# Altium schematic sheet [04] - USB-UART.SchDoc
size A4
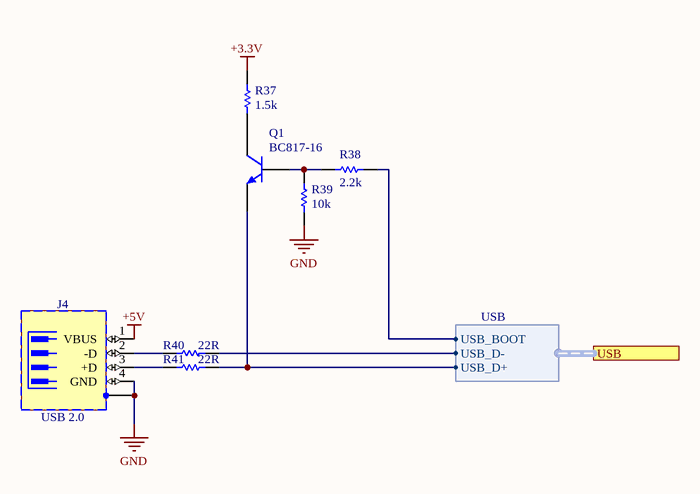
[diagram p0: [04] - USB-UART.SchDoc]

## Parts
J4  USB 2.0  [WURTH_614 104 150 121]
Q1  BC817-16  [SOT23-3]
R37  Resistance: 1.5k  [Res-0603]  (hidden comment: Res1)
R38  Resistance: 2.2k  [Res-0603]  (hidden comment: Res1)
R39  Resistance: 10k  [Res-0603]  (hidden comment: Res1)
R40  Resistance: 22R  [Res-0603]  (hidden comment: Res1)
R41  Resistance: 22R  [Res-0603]  (hidden comment: Res1)

## Ports
USB (harness USB)

## Harnesses
USB: USB_BOOT, USB_D-, USB_D+

## Nets
+3.3V: R37.1
+5V: J4.1(VBUS)
GND: J4.4(GND) J4.5(SHIELD) R39.1
NetJ4_2: J4.2(-D) R40.2
NetJ4_3: J4.3(+D) R41.2
NetQ1_1: Q1.1(B) R38.1 R39.2
NetQ1_2: Q1.2(E) R41.1 ; port USB.USB_D+
NetQ1_3: Q1.3(C) R37.2
NetR38_2: R38.2 ; port USB.USB_BOOT
NetR40_1: R40.1 ; port USB.USB_D-

## Notes on the sheet
- Title
- Size:
- Date:
- A4
- Number:
- Time:
- Revision:
- Sheet
- of
- File:

## Library data of the parts
J4 = WURTH_614 104 150 121: 4 Pin + 1 Shield USB Receptacle; Part Description: USB 2.0 Type A Receptacle, Right Angle, SLIM Type, 4 Contacts; Manufacturer: WURTH ELEKTRONIK; PressFit: No; Number of Contacts: 4; Part Number: WURTH_614 104 150 121; Component Kind: Standard; Component Type: Standard; Pin Count: 5; Family: USB 2.0; Mounted: Yes; Socket: No; SMD: No; Sense: No; Status: None; Manufacturer Part Number: 614 104 150 121; ComponentHeight: 7.2mm; HelpURL: \\cern.ch\dfs\Applications\Altium\Datasheets\WURTH_614 104 150 121.pdf; Author: CERN DEM JMW; CreateDate: 07.07.2015; LatestRevisionDate: 07.07.2015; Supplier 1: Digi-Key; Supplier Part Number 1: 732-5962-6-ND; Stock 1: 1074; Pricing 1: 1=2.1, 10=1.927, 50=1.784, 100=1.641 (USD); Mount: Through Hole,Horizontal; Contact Material: Copper Alloy; Contact Plating: Gold; Packaging: Tape and Reel; Connector Type: USB; Gender: Receptacle; Orientation: Right Angle; USB Standard: USB 2.0; REACH SVHC: Unknown; ComponentLink1URL: https://www.distrelec.biz/Web/Downloads/40/28/614104150121.pdf?mime=application%2Fpdf; ComponentLink1Description: https://www.distrelec.biz/Web/Downloads/40/28/614104150121.pdf?mime=application%2Fpdf; ComponentLink2URL: http://katalog.we-online.de/em/datasheet/614104150121.pdf; ComponentLink2Description: http://katalog.we-online.de/em/datasheet/614104150121.pdf; ComponentLink3URL: http://www.farnell.com/cad/2130935.pdf; ComponentLink3Description: http://www.farnell.com/cad/2130935.pdf; ComponentLink4URL: http://www.farnell.com/cad/1889803.pdf; ComponentLink4Description: http://www.farnell.com/cad/1889803.pdf
Q1 = BC817-16: NPN General-purpose Transistor; Manufacturer: ON Semiconductor; Manufacturer Part Number: BC817-16LT3G; hFE Min: 100; Max Power Dissipation: 300mW; Collector Emitter Voltage (VCEO): 45V; Max Collector Current: 500mA; Transition Frequency: 100MHz; Collector Base Voltage (VCBO): 50V; Emitter Base Voltage (VEBO): 5V; Collector Emitter Saturation Voltage: 700mV; Element Configuration: Single; Number of Elements: 1; ComponentLink1URL: http://www.mccsemi.com/up_pdf/BC817-16~BC817-40(SOT-23).pdf; ComponentLink1Description: http://www.mccsemi.com/up_pdf/BC817-16~BC817-40(SOT-23).pdf; Supplier 1: Digi-Key; Supplier Part Number 1: BC817-16LT3GOSDKR-ND; Stock 1: 22032; Pricing 1: 1=0.13, 10=0.121, 100=0.0658, 500=0.04048, 1000=0.02759 (USD); Case/Package: SOT-23-3; Number of Pins: 3; Contact Plating: Tin,Matte; Min Operating Temperature: -55°C; Max Operating Temperature: 150°C; Package Quantity: 10000; Packaging: Tape and Reel; Collector Emitter Breakdown Voltage: 45V; Polarity: NPN; Power Dissipation: 300mW; Frequency: 100MHz; Max Breakdown Voltage: 45V; Gain Bandwidth Product: 100MHz; Radiation Hardening: No; Lead Free: Lead Free; Halogen Free: Halogen Free; ComponentLink2URL: https://datasheet.ciiva.com/15139/getdatasheetpartid-84401-15139109.pdf; ComponentLink2Description: https://datasheet.ciiva.com/15139/getdatasheetpartid-84401-15139109.pdf; ComponentLink3URL: https://datasheet.ciiva.com/980/bc817-16lt1-d-980715.pdf; ComponentLink3Description: https://datasheet.ciiva.com/980/bc817-16lt1-d-980715.pdf; ComponentLink4URL: https://datasheet.ciiva.com/26115/bc817-16lt1-d-26115598.pdf; ComponentLink4Description: https://datasheet.ciiva.com/26115/bc817-16lt1-d-26115598.pdf; ComponentLink5URL: https://datasheet.ciiva.com/11204/bc817-16lt1-d-11204335.pdf; ComponentLink5Description: https://datasheet.ciiva.com/11204/bc817-16lt1-d-11204335.pdf
R37 = 1: Chip Resistor; Manufacturer: Panasonic; Manufacturer Part Number: ERJ-3EKF1501V; Power Rating: 100mW; Tolerance: 1%; Voltage Rating: 75V; Temperature Coefficient: 100ppm/°C; Supplier 1: Digi-Key; Supplier Part Number 1: P1.50KHDKR-ND; Stock 1: 965786; Pricing 1: 1=0.1, 10=0.079, 100=0.0323, 1000=0.01449, 2500=0.01258 (USD); Mount: Surface Mount; Case/Package: 0603; Number of Pins: 2; Weight: 7.1E-05oz; Case Code (Metric): 1608; Case Code (Imperial): 0603; Contact Plating: Tin; Min Operating Temperature: -55°C; Max Operating Temperature: 155°C; Packaging: Tape and Reel; Package Quantity: 1; Composition: Thick Film; Number of Terminations: 2; Termination: SMD/SMT; Military Standard: Not; Max Power Dissipation: 100mW; Voltage Rating (DC): 75V; Features: Automotive AEC-Q200; Length: 1.6mm; Height: 0.45mm; Width: 0.031inch; Depth: 0.8mm; Radiation Hardening: No; REACH SVHC: No SVHC; Lead Free: Lead Free; ComponentLink1URL: https://datasheet.ciiva.com/34303/1987644-34303574.pdf; ComponentLink1Description: https://datasheet.ciiva.com/34303/1987644-34303574.pdf; ComponentLink2URL: https://datasheet.ciiva.com/7830/426256-7830981.pdf; ComponentLink2Description: https://datasheet.ciiva.com/7830/426256-7830981.pdf; ComponentLink3URL: https://datasheet.ciiva.com/9198/aoa0000ce2-9198086.pdf; ComponentLink3Description: https://datasheet.ciiva.com/9198/aoa0000ce2-9198086.pdf; ComponentLink4URL: https://datasheet.ciiva.com/48530/aoa0000ce2-48530982.pdf; ComponentLink4Description: https://datasheet.ciiva.com/48530/aoa0000ce2-48530982.pdf; ComponentLink5URL: https://datasheet.ciiva.com/16511/aoa0000ce2-16511927.pdf; ComponentLink5Description: https://datasheet.ciiva.com/16511/aoa0000ce2-16511927.pdf; ComponentLink6URL: https://datasheet.ciiva.com/17214/aoa0000ce2-17214761.pdf; ComponentLink6Description: https://datasheet.ciiva.com/17214/aoa0000ce2-17214761.pdf; ComponentLink7URL: https://datasheet.ciiva.com/28514/1678782-28514202.pdf; ComponentLink7Description: https://datasheet.ciiva.com/28514/1678782-28514202.pdf; ComponentLink8URL: https://datasheet.ciiva.com/7830/aoa0000ce2-7830731.pdf; ComponentLink8Description: https://datasheet.ciiva.com/7830/aoa0000ce2-7830731.pdf; ComponentLink9URL: https://datasheet.ciiva.com/16449/aoa0000ce2-16449406.pdf; ComponentLink9Description: https://datasheet.ciiva.com/16449/aoa0000ce2-16449406.pdf; ComponentLink10URL: https://datasheet.ciiva.com/16767/70260748-16767326.pdf; ComponentLink10Description: https://datasheet.ciiva.com/16767/70260748-16767326.pdf; ComponentLink11URL: https://datasheet.ciiva.com/16759/70260748-16759967.pdf; ComponentLink11Description: https://datasheet.ciiva.com/16759/70260748-16759967.pdf; ComponentLink12URL: https://datasheet.ciiva.com/24124/aoa0000ce2-24124271.pdf; ComponentLink12Description: https://datasheet.ciiva.com/24124/aoa0000ce2-24124271.pdf
R38 = 1: Chip Resistor; Manufacturer: Panasonic; Manufacturer Part Number: ERJ-3GEYJ222V; Power Rating: 100mW; Tolerance: 5%; Voltage Rating: 75V; Temperature Coefficient: 200ppm/°C; Voltage Rating (DC): 50V; Supplier 1: Digi-Key; Supplier Part Number 1: P2.2KGDKR-ND; Stock 1: 1578287; Pricing 1: 1=0.1, 10=0.054, 100=0.022, 1000=0.00988, 2500=0.00858 (USD); Mount: Surface Mount; Case/Package: 0603; Case Code (Imperial): 0603; Case Code (Metric): 1608; Contact Plating: Tin; Min Operating Temperature: -55°C; Max Operating Temperature: 155°C; Package Quantity: 1; Packaging: Tape and Reel; Composition: Thick Film; Number of Terminations: 2; Military Standard: Not; Termination: SMD/SMT; Max Power Dissipation: 100mW; Features: Automotive AEC-Q200; Working Voltage: 75V; Length: 1.6mm; Height: 0.45mm; Width: 0.8mm; Depth: 0.8mm; Radiation Hardening: No; REACH SVHC: No SVHC; Lead Free: Lead Free; ComponentLink1URL: https://datasheet.ciiva.com/11821/0900766b80f806dd-11821453.pdf; ComponentLink1Description: https://datasheet.ciiva.com/11821/0900766b80f806dd-11821453.pdf; ComponentLink2URL: https://datasheet.ciiva.com/34303/1988639-34303614.pdf; ComponentLink2Description: https://datasheet.ciiva.com/34303/1988639-34303614.pdf; ComponentLink3URL: https://datasheet.ciiva.com/16760/70255313-16760341.pdf; ComponentLink3Description: https://datasheet.ciiva.com/16760/70255313-16760341.pdf; ComponentLink4URL: https://datasheet.ciiva.com/9117/aoa0000ce1-9117127.pdf; ComponentLink4Description: https://datasheet.ciiva.com/9117/aoa0000ce1-9117127.pdf; ComponentLink5URL: https://datasheet.ciiva.com/46380/1500035-46380411.pdf; ComponentLink5Description: https://datasheet.ciiva.com/46380/1500035-46380411.pdf; ComponentLink6URL: https://datasheet.ciiva.com/16765/70255313-16765244.pdf; ComponentLink6Description: https://datasheet.ciiva.com/16765/70255313-16765244.pdf; ComponentLink7URL: https://datasheet.ciiva.com/16199/aoa0000ce1-16199902.pdf; ComponentLink7Description: https://datasheet.ciiva.com/16199/aoa0000ce1-16199902.pdf; ComponentLink8URL: https://datasheet.ciiva.com/16853/aoa0000ce1-16853407.pdf; ComponentLink8Description: https://datasheet.ciiva.com/16853/aoa0000ce1-16853407.pdf; ComponentLink9URL: https://datasheet.ciiva.com/22758/1500035-22758223.pdf; ComponentLink9Description: https://datasheet.ciiva.com/22758/1500035-22758223.pdf; ComponentLink10URL: https://datasheet.ciiva.com/28584/1678796-28584095.pdf; ComponentLink10Description: https://datasheet.ciiva.com/28584/1678796-28584095.pdf
R39 = 1: Chip Resistor; Manufacturer: Panasonic; Manufacturer Part Number: ERJ-3GEYJ103V; Tolerance: 5%; Power Rating: 100mW; Voltage Rating: 75V; Temperature Coefficient: 200ppm/°C; Voltage Rating (DC): 50V; Supplier 1: Digi-Key; Supplier Part Number 1: P10KGDKR-ND; Stock 1: 10740434; Pricing 1: 1=0.1, 10=0.054, 100=0.022, 1000=0.00988, 2500=0.00858 (USD); Mount: Surface Mount; Case/Package: 0603; Weight: 7.1E-05oz; Case Code (Imperial): 0603; Case Code (Metric): 1608; Contact Plating: Tin; Min Operating Temperature: -55°C; Max Operating Temperature: 155°C; Packaging: Tape and Reel; Package Quantity: 1; Composition: Thick Film; Termination: SMD/SMT; Number of Terminations: 2; Military Standard: Not; Max Power Dissipation: 100mW; Working Voltage: 75V; Features: Automotive AEC-Q200; Length: 1.6mm; Height: 0.45mm; Width: 0.8mm; Depth: 0.8mm; REACH SVHC: No SVHC; Lead Free: Lead Free; ComponentLink1URL: https://datasheet.ciiva.com/34303/2007265-34303757.pdf; ComponentLink1Description: https://datasheet.ciiva.com/34303/2007265-34303757.pdf; ComponentLink2URL: https://datasheet.ciiva.com/11809/0900766b80f806dd-11809566.pdf; ComponentLink2Description: https://datasheet.ciiva.com/11809/0900766b80f806dd-11809566.pdf; ComponentLink3URL: https://datasheet.ciiva.com/28514/1678796-28514213.pdf; ComponentLink3Description: https://datasheet.ciiva.com/28514/1678796-28514213.pdf; ComponentLink4URL: https://datasheet.ciiva.com/30147/4aoa0000ce1-30147029.pdf; ComponentLink4Description: https://datasheet.ciiva.com/30147/4aoa0000ce1-30147029.pdf; ComponentLink5URL: https://datasheet.ciiva.com/46371/1678796-46371909.pdf; ComponentLink5Description: https://datasheet.ciiva.com/46371/1678796-46371909.pdf; ComponentLink6URL: https://datasheet.ciiva.com/24133/aoa0000ce1-37422-24133064.pdf; ComponentLink6Description: https://datasheet.ciiva.com/24133/aoa0000ce1-37422-24133064.pdf; ComponentLink7URL: https://datasheet.ciiva.com/46385/1678796-46385240.pdf; ComponentLink7Description: https://datasheet.ciiva.com/46385/1678796-46385240.pdf; ComponentLink8URL: https://datasheet.ciiva.com/17212/aoa0000ce1-17212106.pdf; ComponentLink8Description: https://datasheet.ciiva.com/17212/aoa0000ce1-17212106.pdf; ComponentLink9URL: https://datasheet.ciiva.com/9117/aoa0000ce1-9117038.pdf; ComponentLink9Description: https://datasheet.ciiva.com/9117/aoa0000ce1-9117038.pdf; ComponentLink10URL: https://datasheet.ciiva.com/16740/aoa0000ce1-16740655.pdf; ComponentLink10Description: https://datasheet.ciiva.com/16740/aoa0000ce1-16740655.pdf; ComponentLink11URL: https://datasheet.ciiva.com/48531/aoa0000ce1-48531887.pdf; ComponentLink11Description: https://datasheet.ciiva.com/48531/aoa0000ce1-48531887.pdf
R40 R41 = 1: Chip Resistor; Manufacturer: Panasonic; Manufacturer Part Number: ERJ-3GEYJ220V; Power Rating: 100mW; Tolerance: 5%; Voltage Rating: 75V; Temperature Coefficient: 200ppm/°C; Voltage Rating (DC): 50V; Supplier 1: Digi-Key; Supplier Part Number 1: P22GDKR-ND; Stock 1: 938288; Pricing 1: 1=0.1, 10=0.054, 100=0.022, 1000=0.00988, 2500=0.00858 (USD); Mount: Surface Mount; Case/Package: 0603; Case Code (Metric): 1608; Case Code (Imperial): 0603; Contact Plating: Tin; Min Operating Temperature: -55°C; Max Operating Temperature: 155°C; Packaging: Tape and Reel; Package Quantity: 1; Composition: Thick Film; Number of Terminations: 2; Termination: SMD/SMT; Military Standard: Not; Max Power Dissipation: 100mW; Features: Automotive AEC-Q200; Length: 1.6mm; Height: 0.45mm; Width: 0.031inch; Depth: 0.8mm; Radiation Hardening: No; REACH SVHC: No SVHC; Lead Free: Lead Free; ComponentLink1URL: https://datasheet.ciiva.com/11821/0900766b80f806dd-11821421.pdf; ComponentLink1Description: https://datasheet.ciiva.com/11821/0900766b80f806dd-11821421.pdf; ComponentLink2URL: https://datasheet.ciiva.com/16775/70255313-16775287.pdf; ComponentLink2Description: https://datasheet.ciiva.com/16775/70255313-16775287.pdf; ComponentLink3URL: https://datasheet.ciiva.com/17210/aoa0000ce1-17210855.pdf; ComponentLink3Description: https://datasheet.ciiva.com/17210/aoa0000ce1-17210855.pdf; ComponentLink4URL: https://datasheet.ciiva.com/24071/aoa0000ce1-37422-24071191.pdf; ComponentLink4Description: https://datasheet.ciiva.com/24071/aoa0000ce1-37422-24071191.pdf; ComponentLink5URL: https://datasheet.ciiva.com/28546/1678796-28546119.pdf; ComponentLink5Description: https://datasheet.ciiva.com/28546/1678796-28546119.pdf; ComponentLink6URL: https://datasheet.ciiva.com/48531/aoa0000ce1-48531767.pdf; ComponentLink6Description: https://datasheet.ciiva.com/48531/aoa0000ce1-48531767.pdf; ComponentLink7URL: https://datasheet.ciiva.com/28686/1678796-28686939.pdf; ComponentLink7Description: https://datasheet.ciiva.com/28686/1678796-28686939.pdf; ComponentLink8URL: https://datasheet.ciiva.com/5868/1500035-5868156.pdf; ComponentLink8Description: https://datasheet.ciiva.com/5868/1500035-5868156.pdf; ComponentLink9URL: https://datasheet.ciiva.com/9117/aoa0000ce1-9117118.pdf; ComponentLink9Description: https://datasheet.ciiva.com/9117/aoa0000ce1-9117118.pdf; ComponentLink10URL: https://datasheet.ciiva.com/16517/aoa0000ce1-16517054.pdf; ComponentLink10Description: https://datasheet.ciiva.com/16517/aoa0000ce1-16517054.pdf